# Altium project Mikrofonvorverstärker.PrjPcb
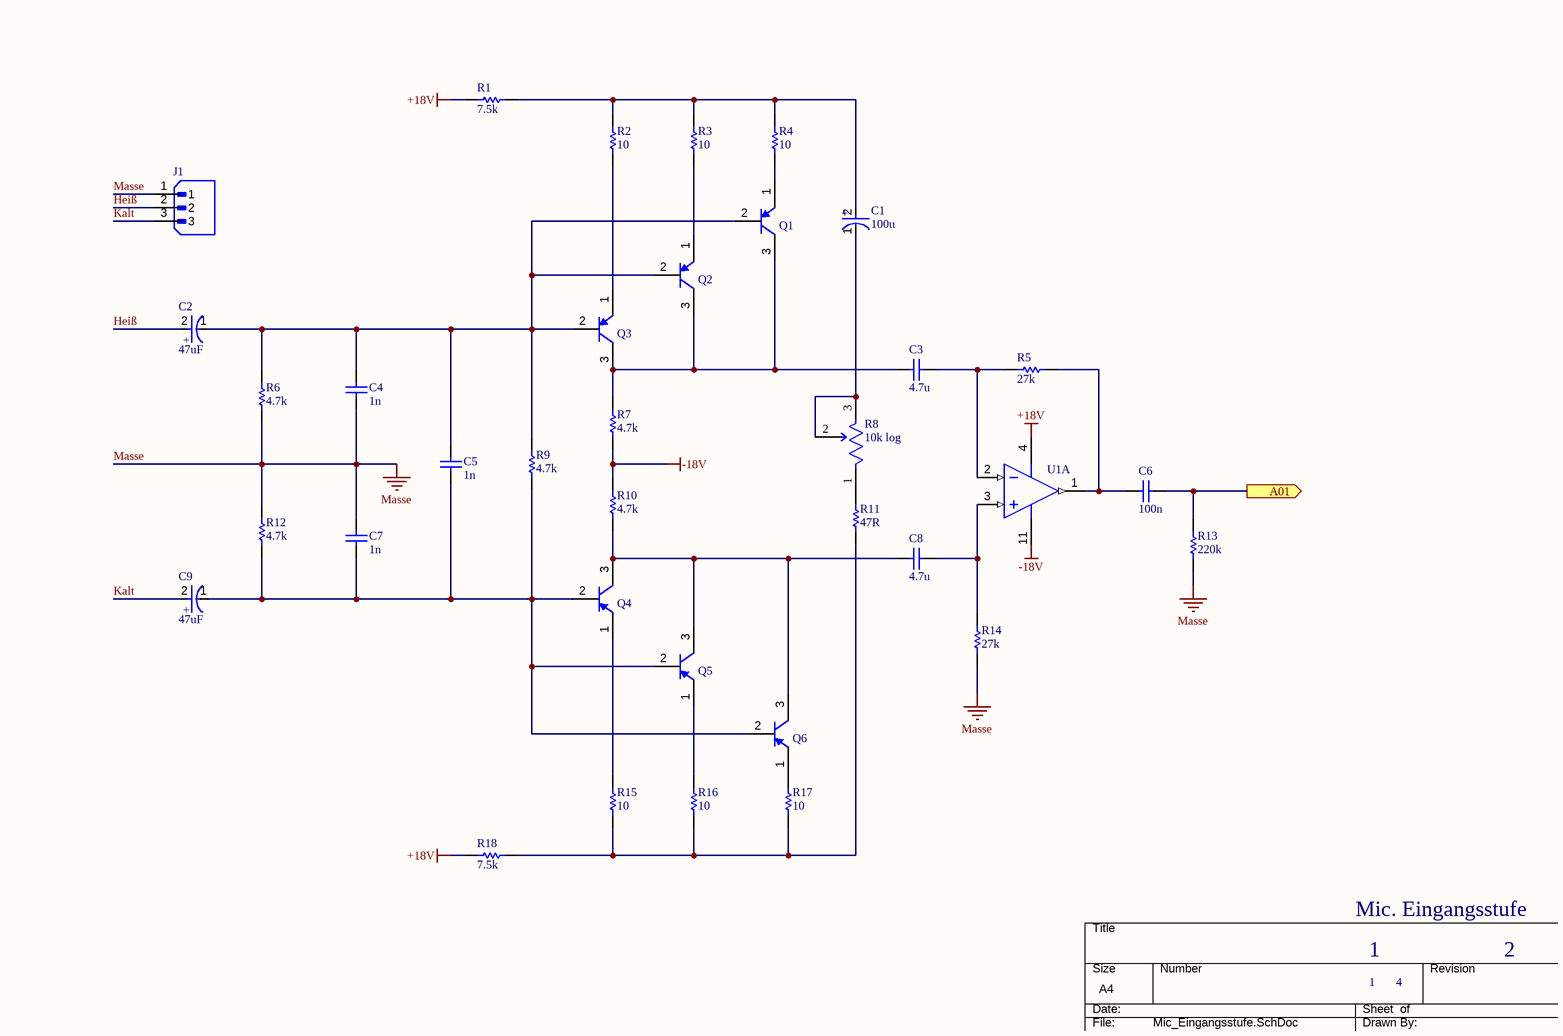
[diagram p0: Mic_Eingangsstufe.SchDoc]
4 sheets, 137 parts. Net scope: flat (ports and power ports of the same name join across sheets).
Board file: Mikrofonvorverstärker.PcbDoc
Sheets:
  Mic_Eingangsstufe.SchDoc
  Linkwitz_Riley.SchDoc
  Parametrischer_EQ.SchDoc
  AUX_Stufe.SchDoc

## Sheet Mic_Eingangsstufe.SchDoc: Mic. Eingangsstufe
size A4; Organization: Altium Limited; Address1: L3, 12a Rodborough Rd; Address2: Frenchs Forest; Address3: NSW; Address4: Australia 2086; DocumentNumber: 1; Revision: 2; SheetNumber: 1; SheetTotal: 4

### Parts
C1  100u  [4141 Kondensator]
C2  47uF  [2626 Kondensator]
C3  4.7u  [0805]
C4  1n  [0805]
C5  1n  [0805]
C6  100n  [0805]
C7  1n  [0805]
C8  4.7u  [0805]
C9  47uF  [2626 Kondensator]
J1  Connector x3  [Connector x3]  (value not drawn)
Q1  PNP  [Buchsenleiste 3 Fach PNP TO92]  (value not drawn)
Q2  PNP  [Buchsenleiste 3 Fach PNP TO92]  (value not drawn)
Q3  PNP  [Buchsenleiste 3 Fach PNP TO92]  (value not drawn)
Q4  PNP  [Buchsenleiste 3 Fach PNP TO92]  (value not drawn)
Q5  PNP  [Buchsenleiste 3 Fach PNP TO92]  (value not drawn)
Q6  PNP  [Buchsenleiste 3 Fach PNP TO92]  (value not drawn)
R1  7.5k  [0805]
R2  10  [0805]
R3  10  [0805]
R4  10  [0805]
R5  27k  [0805]
R6  4.7k  [0805]
R7  4.7k  [0805]
R8  10k log  [Connector x3]
R9  4.7k  [0805]
R10  4.7k  [0805]
R11  47R  [0805]
R12  4.7k  [0805]
R13  220k  [0805]
R14  27k  [0805]
R15  10  [0805]
R16  10  [0805]
R17  10  [0805]
R18  7.5k  [0805]
U1  OPA4134UA  [DIP14 IC Socket]  (value not drawn)  (part A of 4)

### Ports
A01 (out)

### Nets
+18V: R1.1 R18.1 U1.4(V+)
-18V: R7.1 R10.2 U1.11(V-)
Masse: C4.1 C7.2 J1.1 R6.1 R12.2 R13.1 R14.1
Heiß: C2.2(A) J1.2
Kalt: C9.2(A) J1.3
NetC1_1: C1.1(C) R8.2(b) R8.3(c)
NetC1_2: C1.2(A) R1.2 R2.1 R3.1 R4.1
NetC2_1: C2.1(C) C4.2 C5.2 Q1.2(B) Q2.2(B) Q3.2(B) R6.2 R9.2
NetC3_1: C3.1 R5.2 U1.2(IN_A-)
NetC3_2: C3.2 Q1.3(C) Q2.3(C) Q3.3(C) R7.2
NetC5_1: C5.1 C7.1 C9.1(C) Q4.2(B) Q5.2(B) Q6.2(B) R9.1 R12.1
NetC6_1: C6.1 R5.1 U1.1(OUT_A)
NetC6_2: C6.2 R13.2 ; port A01
NetC8_1: C8.1 R14.2 U1.3(IN_A+)
NetC8_2: C8.2 Q4.3(C) Q5.3(C) Q6.3(C) R10.1
NetQ1_1: Q1.1(E) R4.2
NetQ2_1: Q2.1(E) R3.2
NetQ3_1: Q3.1(E) R2.2
NetQ4_1: Q4.1(E) R15.2
NetQ5_1: Q5.1(E) R16.2
NetQ6_1: Q6.1(E) R17.2
NetR8_1: R8.1(a) R11.2
NetR11_1: R11.1 R15.1 R16.1 R17.1 R18.2

### Notes on the sheet
- THIS DOCUMENT AND THE DATA DISCLOSED HEREIN OR
- HEREWITH IS THE PROPERTY OF ALTIUM LIMITED AND MAY
- DWG NO:
- REVISION
- REV:
- DESCRIPTION
- DATE
- APPROVED
- BE FREELY DISTRIBUTED IN WHOLE. NO RIGHTS ARE
- RESERVED OR EXPRESS OR IMPLIED WARANTEE GIVEN.
- ENG:
- APPROVALS
- PROJECT
- DSN:
- CHK:
- REFERENCE DOCUMENTS
- PROJECT REVISION:
- TITLE
- DOCUMENT REVISION:
- DESIGN ITEM:
- BOM:
- FAB DWG:
- PCB DWG:
- ASSY DWG:
- SCALE:
- A3
- SIZE
- CAGE CODE
- FILE NAME
- DWG NO.
- SHEET
- OF
- REV
- (in symbol 2626 Kondensator) +
- (in symbol 4141 Kondensator) +

### Library data of the parts
C1 = 4141 Kondensator: 4141Kondensator; Value: 100u
C2 C9 = 2626 Kondensator: 2626 Kondensator d=6.6mm; Ripple Current: 2.8A; Voltage: 25V; Polarity: Polar; Leakage Current: 235uA; Tolerance: 20%; Dissipation Factor: 12%; ESR (Equivalent Series Resistance): 30mR; Life (Hours): 5000Hour; Diameter: 6.3mm; Package Quantity: 1000; Packaging: Tape and Reel; Height - Seated (Max): 0.236inch; Case/Package: Radial; Termination: SMD/SMT; Series: OS-CON™, SVPF; Number of Pins: 6; Value: 47uF; Min Operating Temperature: -55°C; Mount: Surface Mount; RoHS Compliant: Yes; Voltage Rating (DC): 25V; Length: 5.9mm; REACH SVHC: No SVHC; Voltage Rating: 25V; Ripple Current (AC): 2.8A; Height: 5.9mm; Max Operating Temperature: 105°C
C3-C8 = 0805 Kondensator
  C3 C8: Value: 4.7u
  C4 C5 C7: Value: 1n
  C6: Value: 100n
J1 = Connector x3: Connector Header Through Hole 3 position 0.100 (2.54mm); MF: JST Sales; MP: B3B-XH-A; SnapEDA_Link: https://www.snapeda.com/parts/B3B-XH-A/JST+Sales+America+Inc./view-part/?ref=snap; Package: None; Value: *; Check_prices: https://www.snapeda.com/parts/B3B-XH-A/JST+Sales+America+Inc./view-part/?ref=eda
Q1-Q6 = TO-92 PNP BUchsenleiste: TO-92 PNP Bipolar Transistor; Typ: PNP
R1-R7 R9-R18 = 0805 Widerstand
  R1 R18: Value: 7.5k
  R2-R4 R15-R17: Value: 10
  R5 R14: Value: 27k
  R6 R7 R9 R10 R12: Value: 4.7k
  R11: Value: 47R
  R13: Value: 220k
R8 = Potentiometer Buchsenleiste: Potentiometer; Value: 10k log
U1 = SOIC OPA4134UA: SoundPlus(TM) High Performance Audio Operational Amplifier, 5 to 36 V, -55 to 125 degC, 14-pin SOIC (D14), Green (RoHS & no Sb/Br); Manufacturer: Texas Instruments; Vmax(V): 36; Number of Channels: 4; Iq per channel(Max)(mA): 5; GBW(Typ)(MHz): 8; DatasheetVersion: SBOS058; ComponentLink2URL: http://www.ti.com/general/docs/lit/getliterature.tsp?genericPartNumber=OPA4134&fileType=pdf; ComponentLink1URL: http://www.ti.com/; PackageDescription: 14-Pin Plastic Small Outline, Body 8.65 x 3.9 mm, Pitch 1.27 mm; SubFamily: Audio Operational Amplifier; Vmin(V): 5; ComponentLink2Description: Datasheet; PackageVersion: 4040047-5/M, 06/2011; Code_JEDEC: MS-012; PackageReference: D0014A; ComponentLink1Description: Manufacturer URL; Vn at Flatband(Typ)(nV/rtHz): 8; Eco-Plan: Green (RoHS & no Sb/Br); Mounting Technology: Surface Mount; ComponentLink3URL: http://www.ti.com/lit/ml/mpds177g/mpds177g.pdf; PartNumber: OPA4134UA; ComponentLink3Description: Package Specification

## Sheet Linkwitz_Riley.SchDoc: Linkwitz-Riley / Entstörkondensator
size A4; DocumentNumber: 2; Revision: 2; SheetNumber: 2; SheetTotal: 4
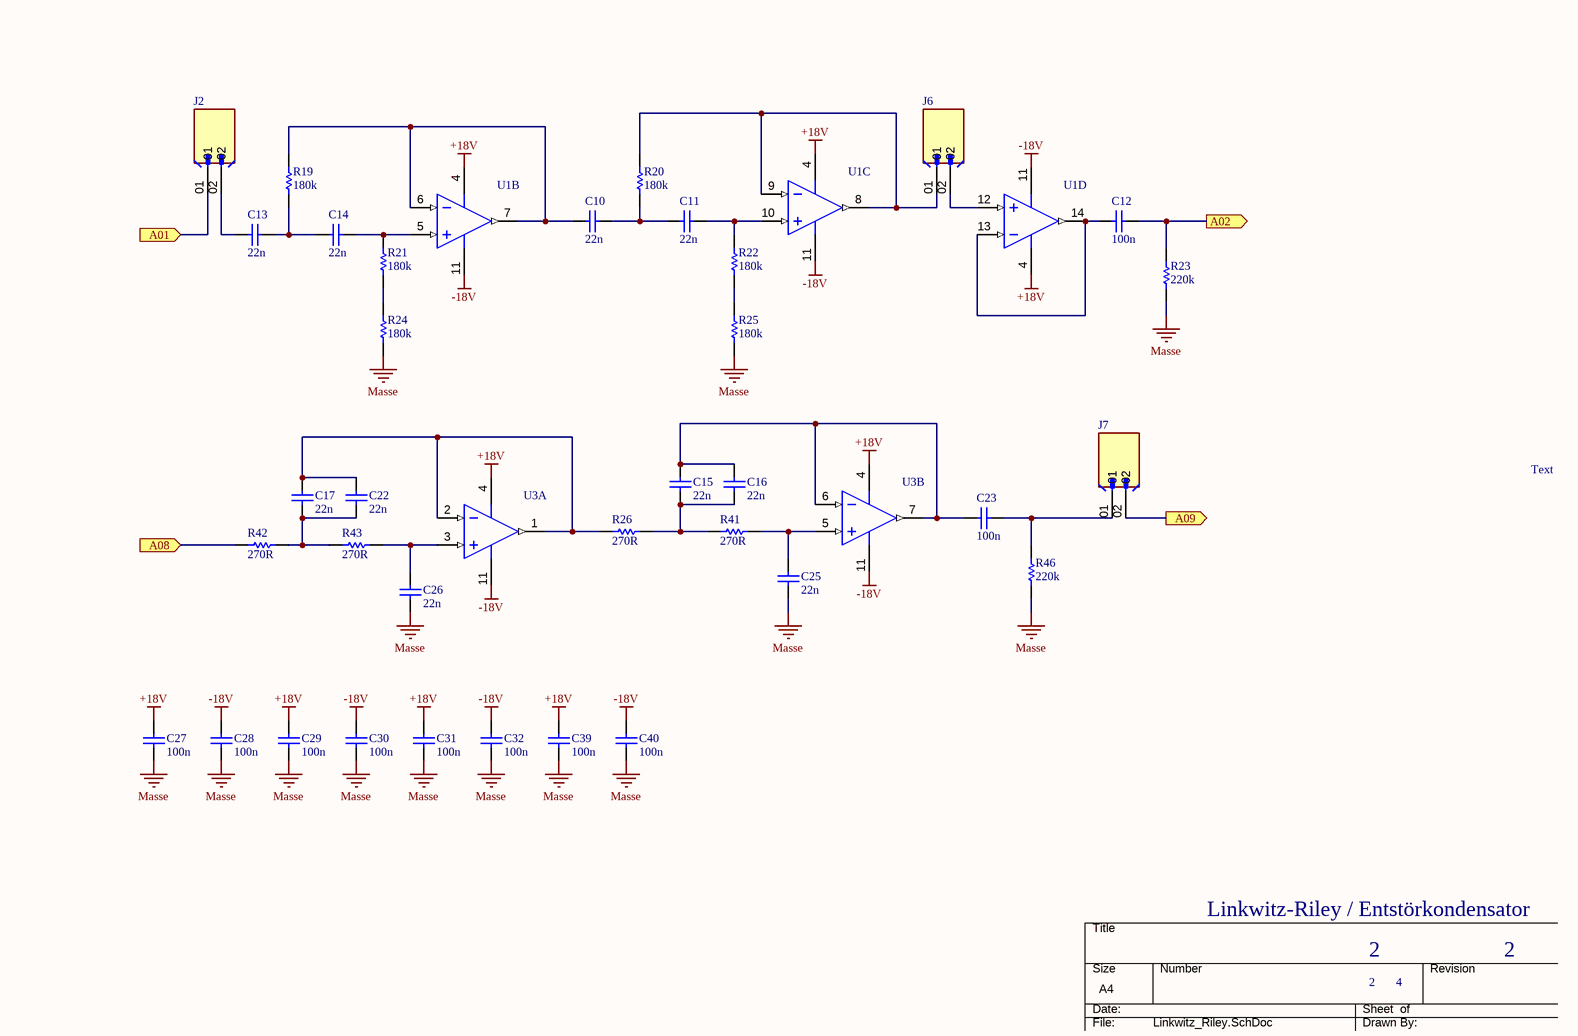
[diagram p1: Linkwitz_Riley.SchDoc]

### Parts
C10  22n  [0805]
C11  22n  [0805]
C12  100n  [0805]
C13  22n  [0805]
C14  22n  [0805]
C15  22n  [0805]
C16  22n  [0805]
C17  22n  [0805]
C22  22n  [0805]
C23  100n  [0805]
C25  22n  [0805]
C26  22n  [0805]
C27  100n  [0805]
C28  100n  [0805]
C29  100n  [0805]
C30  100n  [0805]
C31  100n  [0805]
C32  100n  [0805]
C39  100n  [0805]
C40  100n  [0805]
J2  Connector x2  [Connector x2]  (value not drawn)
J6  Connector x2  [Connector x2]  (value not drawn)
J7  Connector x2  [Connector x2]  (value not drawn)
R19  180k  [0805]
R20  180k  [0805]
R21  180k  [0805]
R22  180k  [0805]
R23  220k  [0805]
R24  180k  [0805]
R25  180k  [0805]
R26  270R  [0805]
R41  270R  [0805]
R42  270R  [0805]
R43  270R  [0805]
R46  220k  [0805]
U1  OPA4134UA  [DIP14 IC Socket]  (value not drawn)  (parts B,C,D of 4)
U3  OPA4134UA  [DIP14 IC Socket]  (value not drawn)  (parts A,B of 4)

### Ports
A01 (in), A02 (out), A08 (in), A09 (out)

### Nets
+18V: C27.2 C29.2 C31.2 C39.2 U1.4(V+) U3.4(V+)
-18V: C28.2 C30.2 C32.2 C40.2 U1.11(V-) U3.11(V-)
Masse: C25.1 C26.1 C27.1 C28.1 C29.1 C30.1 C31.1 C32.1 C39.1 C40.1 R23.1 R24.1 R25.1 R46.1
NetC6_2: J2.01 ; port A01
NetC10_1: C10.1 R19.2 U1.6(IN_B-) U1.7(OUT_B)
NetC10_2: C10.2 C11.1 R20.1
NetC11_2: C11.2 R22.2 U1.10(IN_C+)
NetC12_1: C12.1 U1.13(IN_D-) U1.14(OUT_D)
NetC12_2: C12.2 R23.2 ; port A02
NetC13_1: C13.1 J2.02
NetC13_2: C13.2 C14.1 R19.1
NetC14_2: C14.2 R21.2 U1.5(IN_B+)
NetC15_1: C15.1 C16.1 R26.1 R41.2
NetC15_2: C15.2 C16.2 C23.1 U3.6(IN_B-) U3.7(OUT_B)
NetC17_1: C17.1 C22.1 R42.1 R43.2
NetC17_2: C17.2 C22.2 R26.2 U3.1(OUT_A) U3.2(IN_A-)
NetC23_2: C23.2 J7.01 R46.2
NetC25_2: C25.2 R41.1 U3.5(IN_B+)
NetC26_2: C26.2 R43.1 U3.3(IN_A+)
NetJ5_02: R42.2 ; port A08
NetJ6_01: J6.01 R20.2 U1.8(OUT_C) U1.9(IN_C-)
NetJ6_02: J6.02 U1.12(IN_D+)
NetJ7_02: J7.02 ; port A09
NetR21_1: R21.1 R24.2
NetR22_1: R22.1 R25.2

### Notes on the sheet
- Text
- THIS DOCUMENT AND THE DATA DISCLOSED HEREIN OR
- HEREWITH IS THE PROPERTY OF ALTIUM LIMITED AND MAY
- DWG NO:
- REVISION
- REV:
- DESCRIPTION
- DATE
- APPROVED
- BE FREELY DISTRIBUTED IN WHOLE. NO RIGHTS ARE
- RESERVED OR EXPRESS OR IMPLIED WARANTEE GIVEN.
- ENG:
- APPROVALS
- PROJECT
- DSN:
- CHK:
- REFERENCE DOCUMENTS
- PROJECT REVISION:
- TITLE
- DOCUMENT REVISION:
- DESIGN ITEM:
- BOM:
- FAB DWG:
- PCB DWG:
- ASSY DWG:
- SCALE:
- A3
- SIZE
- CAGE CODE
- FILE NAME
- DWG NO.
- SHEET
- OF
- REV

### Library data of the parts
C10-C17 C22 C23 C25-C32 C39 C40 = 0805 Kondensator
  C10 C11 C13-C17 C22 C25 C26: Value: 22n
  C12 C23 C27-C32 C39 C40: Value: 100n
J2 J6 J7 = Connector x2: Connector Header Through Hole 2 position 0.100 (2.54mm); MF: Wurth Elektronik; MP: 61300211121; SnapEDA_Link: https://www.snapeda.com/parts/61300211121/Wurth+Elektronik/view-part/?ref=snap; Package: None; Value: *; Check_prices: https://www.snapeda.com/parts/61300211121/Wurth+Elektronik/view-part/?ref=eda
R19-R26 R41-R43 R46 = 0805 Widerstand
  R19-R22 R24 R25: Value: 180k
  R23 R46: Value: 220k
  R26 R41-R43: Value: 270R
U1 U3 = SOIC OPA4134UA: as U1 on sheet Mic_Eingangsstufe; DatasheetVersion: SBOS058; ComponentLink2URL: http://www.ti.com/general/docs/lit/getliterature.tsp?genericPartNumber=OPA4134&fileType=pdf; ComponentLink1URL: http://www.ti.com/; PackageDescription: 14-Pin Plastic Small Outline, Body 8.65 x 3.9 mm, Pitch 1.27 mm; SubFamily: Audio Operational Amplifier; Vmin(V): 5; ComponentLink2Description: Datasheet; PackageVersion: 4040047-5/M, 06/2011; Code_JEDEC: MS-012; PackageReference: D0014A; ComponentLink1Description: Manufacturer URL; Vn at Flatband(Typ)(nV/rtHz): 8; Eco-Plan: Green (RoHS & no Sb/Br); Mounting Technology: Surface Mount; ComponentLink3URL: http://www.ti.com/lit/ml/mpds177g/mpds177g.pdf; PartNumber: OPA4134UA; ComponentLink3Description: Package Specification

## Sheet Parametrischer_EQ.SchDoc: Parametrischer EQ / Spannungsregler
size A4 portrait; DocumentNumber: 3; Revision: 2; SheetNumber: 3; SheetTotal: 4
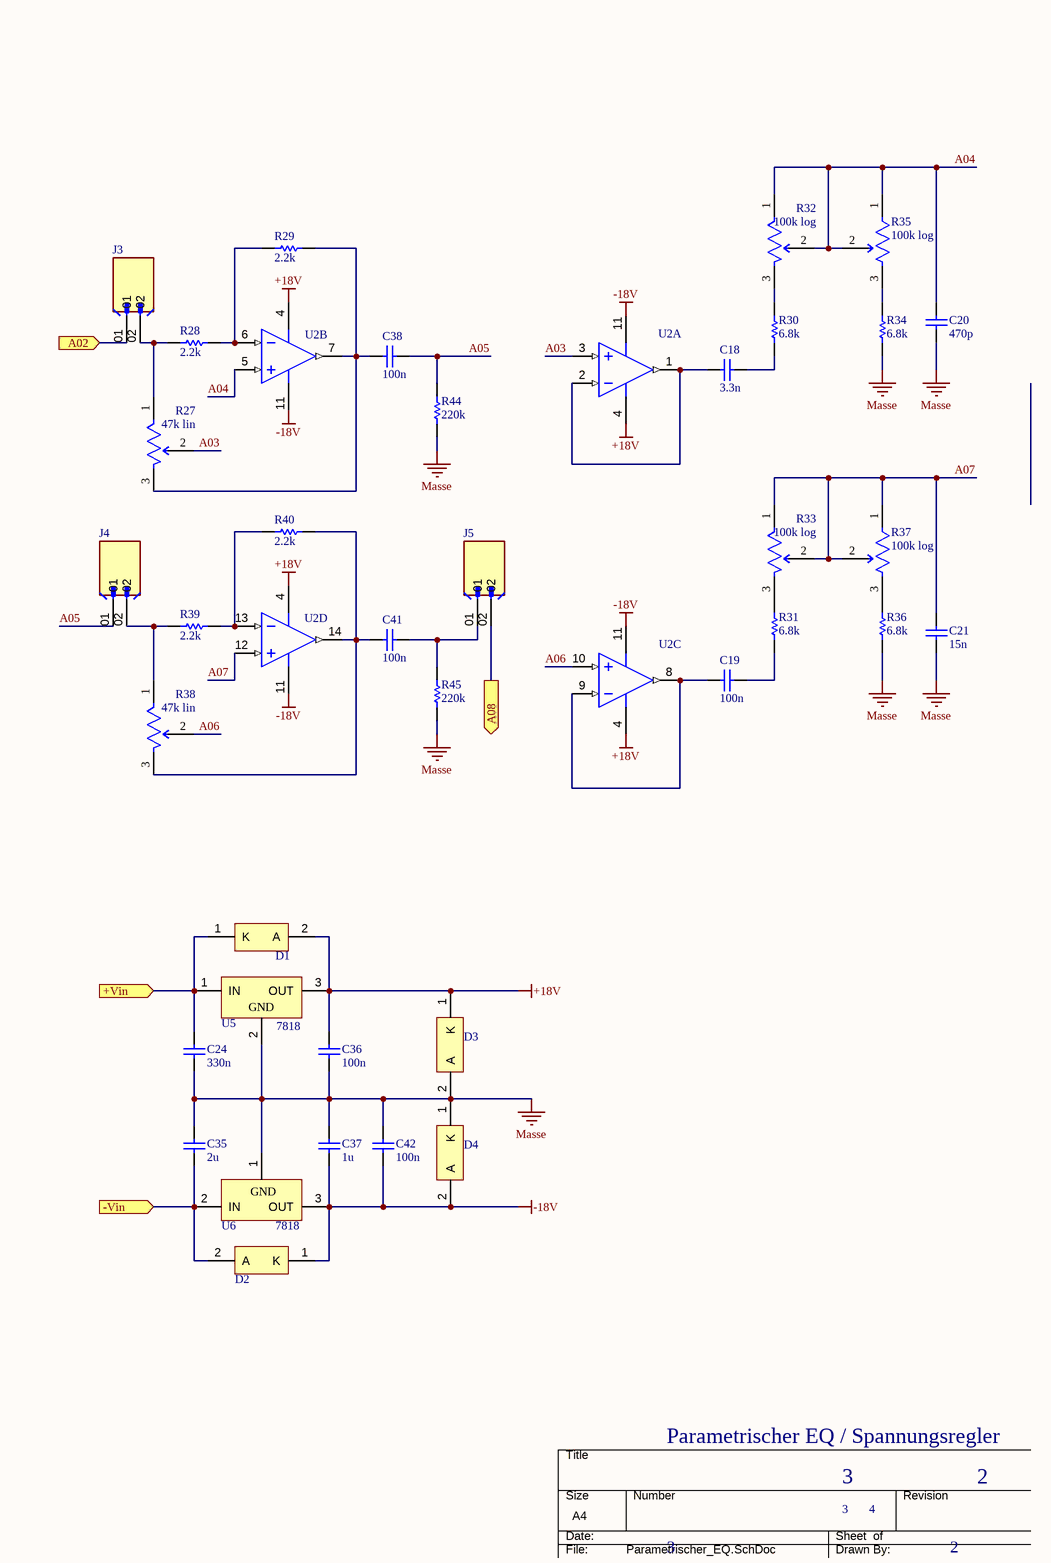
[diagram p2: Parametrischer_EQ.SchDoc]

### Parts
C18  3.3n  [0805]
C19  100n  [0805]
C20  470p  [0805]
C21  15n  [0805]
C24  330n  [0805]
C35  2u  [0805]
C36  100n  [0805]
C37  1u  [0805]
C38  100n  [0805]
C41  100n  [0805]
C42  100n  [0805]
D1  1N4001 Diode  [1N4001 Diode]  (value not drawn)
D2  1N4001 Diode  [1N4001 Diode]  (value not drawn)
D3  1N4001 Diode  [1N4001 Diode]  (value not drawn)
D4  1N4001 Diode  [1N4001 Diode]  (value not drawn)
J3  Connector x2  [Connector x2]  (value not drawn)
J4  Connector x2  [Connector x2]  (value not drawn)
J5  Connector x2  [Connector x2]  (value not drawn)
R27  47k lin  [Connector x3]
R28  2.2k  [0805]
R29  2.2k  [0805]
R30  6.8k  [0805]
R31  6.8k  [0805]
R32  100k log  [Connector x3]
R33  100k log  [Connector x3]
R34  6.8k  [0805]
R35  100k log  [Connector x3]
R36  6.8k  [0805]
R37  100k log  [Connector x3]
R38  47k lin  [Connector x3]
R39  2.2k  [0805]
R40  2.2k  [0805]
R44  220k  [0805]
R45  220k  [0805]
U2  OPA4134UA  [DIP14 IC Socket]  (value not drawn)  (parts A,B,C,D of 4)
U5  7818  [TO220 Spannungsregler 78xx]
U6  7818  [TO220 Spannungsregler 79xx]

### Ports
+Vin (in), -Vin (in), A02 (in), A08 (out)

### Nets
+18V: C36.2 D1.2(A) D3.1(K) U2.4(V+) U5.3(OUT)
-18V: C37.2 C42.1 D2.1(K) D4.2(A) U2.11(V-) U6.3(OUT)
Masse: C20.1 C21.2 C24.1 C35.1 C36.1 C37.1 C42.2 D3.2(A) D4.1(K) R34.1 R36.2 R44.1 R45.1 U5.2(GND) U6.1(GND)
+Vin: C24.2 D1.1(K) U5.1(IN) ; port +Vin
-Vin: C35.2 D2.2(A) U6.2(IN) ; port -Vin
A03: R27.2(b) U2.3(IN_A+)
A04: C20.2 R32.1(a) R32.2(b) R35.1(a) R35.2(b) U2.5(IN_B+)
A05: C38.2 J4.01 R44.2
A06: R38.2(b) U2.10(IN_C+)
A07: C21.1 R33.1(a) R33.2(b) R37.1(a) R37.2(b) U2.12(IN_D+)
NetC12_2: J3.01 ; port A02
NetC18_1: C18.1 U2.1(OUT_A) U2.2(IN_A-)
NetC18_2: C18.2 R30.1
NetC19_1: C19.1 R31.2
NetC19_2: C19.2 U2.8(OUT_C) U2.9(IN_C-)
NetC38_1: C38.1 R27.3(c) R29.2 U2.7(OUT_B)
NetC41_1: C41.1 R38.3(c) R40.2 U2.14(OUT_D)
NetC41_2: C41.2 J5.01 R45.2
NetJ3_02: J3.02 R27.1(a) R28.1
NetJ4_02: J4.02 R38.1(a) R39.1
NetJ5_02: J5.02 ; port A08
NetR28_2: R28.2 R29.1 U2.6(IN_B-)
NetR30_2: R30.2 R32.3(c)
NetR31_1: R31.1 R33.3(c)
NetR34_2: R34.2 R35.3(c)
NetR36_1: R36.1 R37.3(c)
NetR39_2: R39.2 R40.1 U2.13(IN_D-)

### Notes on the sheet
- THIS DOCUMENT AND THE DATA DISCLOSED HEREIN OR
- HEREWITH IS THE PROPERTY OF ALTIUM LIMITED AND MAY
- DWG NO:
- REVISION
- REV:
- DESCRIPTION
- DATE
- APPROVED
- BE FREELY DISTRIBUTED IN WHOLE. NO RIGHTS ARE
- RESERVED OR EXPRESS OR IMPLIED WARANTEE GIVEN.
- ENG:
- APPROVALS
- PROJECT
- DSN:
- CHK:
- REFERENCE DOCUMENTS
- PROJECT REVISION:
- TITLE
- DOCUMENT REVISION:
- DESIGN ITEM:
- BOM:
- FAB DWG:
- PCB DWG:
- ASSY DWG:
- SCALE:
- A3
- SIZE
- CAGE CODE
- FILE NAME
- DWG NO.
- SHEET
- OF
- REV

### Library data of the parts
C18-C21 C24 C35-C38 C41 C42 = 0805 Kondensator
  C18: Value: 3.3n
  C19 C36 C38 C41 C42: Value: 100n
  C20: Value: 470p
  C21: Value: 15n
  C24: Value: 330n
  C35: Value: 2u
  C37: Value: 1u
D1-D4 = 1N4001 Diode: Standard Recovery Rectifier, 2-Pin Axial_Lead, Pb-Free, Bulk Bag; Manufacturer: On Semiconductor; VRRM Max (V): 50; IFSM Max (A): 30; IO(rec) Max (A): 1; ComponentLink3URL: http://www.onsemi.cn/pub_link/Collateral/59-10.PDF; ComponentLink3Description: Package Specification; PartNumber: 1N4001; PackageVersion: Rev. U, 02/2005; Packing: Bulk Bag; ComponentLink2Description: Datasheet; RoHS: TRUE; DatasheetVersion: Rev. 13; PackageReference: AXIAL_LEAD-2-59-10; ComponentLink1URL: http://www.onsemi.com/; Mounting Technology: Through Hole; PackageDescription: 2-Pin, Axial Lead, Diameter 2.35 mm; ComponentLink2URL: http://www.onsemi.com/pub_link/Collateral/1N4001-D.PDF; Type: Standard Recovery; ComponentLink1Description: Manufacturer URL
J3-J5 = Connector x2: as J2 on sheet Linkwitz_Riley; SnapEDA_Link: https://www.snapeda.com/parts/61300211121/Wurth+Elektronik/view-part/?ref=snap; Package: None; Value: *; Check_prices: https://www.snapeda.com/parts/61300211121/Wurth+Elektronik/view-part/?ref=eda
R27 R32 R33 R35 R37 R38 = Potentiometer Buchsenleiste: Potentiometer
  R27 R38: Value: 47k lin
  R32 R33 R35 R37: Value: 100k log
R28-R31 R34 R36 R39 R40 R44 R45 = 0805 Widerstand
  R28 R29 R39 R40: Value: 2.2k
  R30 R31 R34 R36: Value: 6.8k
  R44 R45: Value: 220k
U2 = SOIC OPA4134UA: as U1 on sheet Mic_Eingangsstufe; DatasheetVersion: SBOS058; ComponentLink2URL: http://www.ti.com/general/docs/lit/getliterature.tsp?genericPartNumber=OPA4134&fileType=pdf; ComponentLink1URL: http://www.ti.com/; PackageDescription: 14-Pin Plastic Small Outline, Body 8.65 x 3.9 mm, Pitch 1.27 mm; SubFamily: Audio Operational Amplifier; Vmin(V): 5; ComponentLink2Description: Datasheet; PackageVersion: 4040047-5/M, 06/2011; Code_JEDEC: MS-012; PackageReference: D0014A; ComponentLink1Description: Manufacturer URL; Vn at Flatband(Typ)(nV/rtHz): 8; Eco-Plan: Green (RoHS & no Sb/Br); Mounting Technology: Surface Mount; ComponentLink3URL: http://www.ti.com/lit/ml/mpds177g/mpds177g.pdf; PartNumber: OPA4134UA; ComponentLink3Description: Package Specification
U5 = TO 220 Spannungsregler 78xx: Voltage Regulator, 3-Pin TO-220; Typ: 7818
U6 = TO 220 Spannungsregler 79xx: Voltage Regulator, 3-Pin TO-220; Typ: 7818

## Sheet AUX_Stufe.SchDoc: Ausgangsstufe
size A4 portrait; DocumentNumber: 4; Revision: 2; SheetNumber: 4; SheetTotal: 4
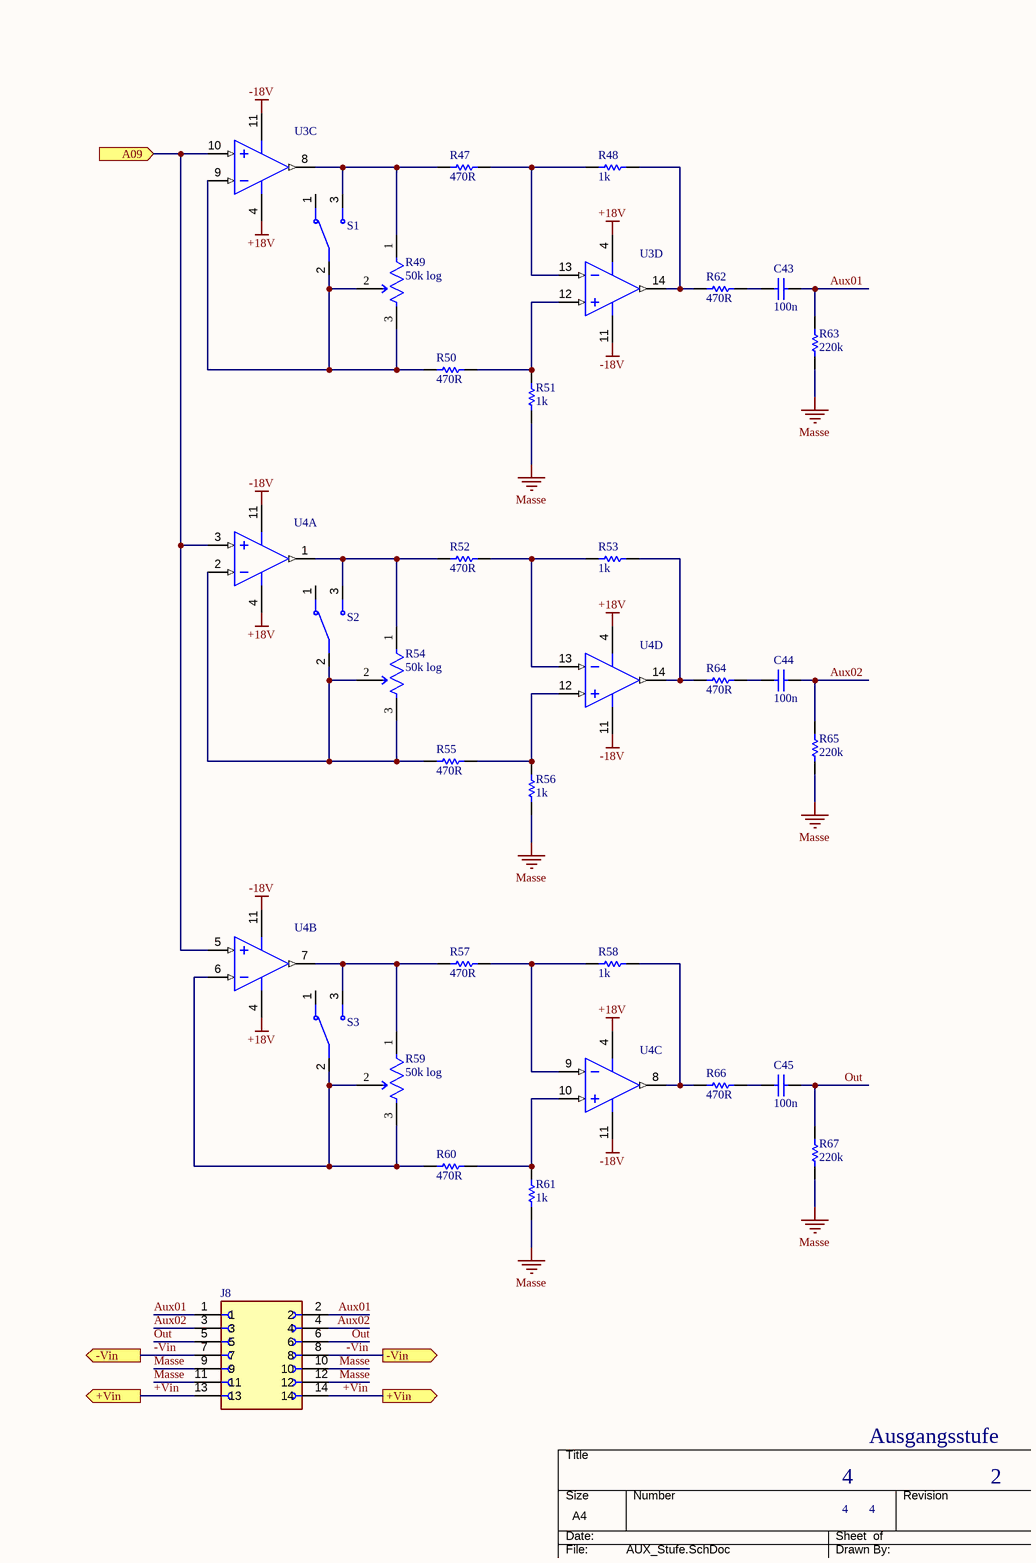
[diagram p3: AUX_Stufe.SchDoc]

### Parts
C43  100n  [0805]
C44  100n  [0805]
C45  100n  [0805]
J8  Connector x14  [Connector x14]  (value not drawn)
R47  470R  [0805]
R48  1k  [0805]
R49  50k log  [Connector x3]
R50  470R  [0805]
R51  1k  [0805]
R52  470R  [0805]
R53  1k  [0805]
R54  50k log  [Connector x3]
R55  470R  [0805]
R56  1k  [0805]
R57  470R  [0805]
R58  1k  [0805]
R59  50k log  [Connector x3]
R60  470R  [0805]
R61  1k  [0805]
R62  470R  [0805]
R63  220k  [0805]
R64  470R  [0805]
R65  220k  [0805]
R66  470R  [0805]
R67  220k  [0805]
S1  Schalter Buchsenleiste  [Connector x3]  (value not drawn)
S2  Schalter Buchsenleiste  [Connector x3]  (value not drawn)
S3  Schalter Buchsenleiste  [Connector x3]  (value not drawn)
U3  OPA4134UA  [DIP14 IC Socket]  (value not drawn)  (parts C,D of 4)
U4  OPA4134UA  [DIP14 IC Socket]  (value not drawn)  (parts A,B,C,D of 4)

### Ports
+Vin (out), -Vin (out), A09 (in)

### Nets
+18V: U3.4(V+) U4.4(V+)
-18V: U3.11(V-) U4.11(V-)
Masse: J8.9 J8.10 J8.11 J8.12 R51.1 R56.1 R61.1 R63.1 R65.1 R67.1
+Vin: J8.13 J8.14 ; port +Vin
-Vin: J8.7 J8.8 ; port -Vin
Aux01: C43.2 J8.1 J8.2 R63.2
Aux02: C44.2 J8.3 J8.4 R65.2
Out: C45.2 J8.5 J8.6 R67.2
NetC43_1: C43.1 R62.2
NetC44_1: C44.1 R64.2
NetC45_1: C45.1 R66.2
NetJ7_02: U3.10(IN_C+) U4.3(IN_A+) U4.5(IN_B+) ; port A09
NetR47_1: R47.1 R49.1(a) S1.3 U3.8(OUT_C)
NetR47_2: R47.2 R48.1 U3.13(IN_D-)
NetR48_2: R48.2 R62.1 U3.14(OUT_D)
NetR49_2: R49.2(b) R49.3(c) R50.1 S1.2 U3.9(IN_C-)
NetR50_2: R50.2 R51.2 U3.12(IN_D+)
NetR52_1: R52.1 R54.1(a) S2.3 U4.1(OUT_A)
NetR52_2: R52.2 R53.1 U4.13(IN_D-)
NetR53_2: R53.2 R64.1 U4.14(OUT_D)
NetR54_2: R54.2(b) R54.3(c) R55.1 S2.2 U4.2(IN_A-)
NetR55_2: R55.2 R56.2 U4.12(IN_D+)
NetR57_1: R57.1 R59.1(a) S3.3 U4.7(OUT_B)
NetR57_2: R57.2 R58.1 U4.9(IN_C-)
NetR58_2: R58.2 R66.1 U4.8(OUT_C)
NetR59_2: R59.2(b) R59.3(c) R60.1 S3.2 U4.6(IN_B-)
NetR60_2: R60.2 R61.2 U4.10(IN_C+)

Not connected (* = marked no-connect by the designer): S1 1; S2 1; S3 1

### Notes on the sheet
- THIS DOCUMENT AND THE DATA DISCLOSED HEREIN OR
- HEREWITH IS THE PROPERTY OF ALTIUM LIMITED AND MAY
- DWG NO:
- REVISION
- REV:
- DESCRIPTION
- DATE
- APPROVED
- BE FREELY DISTRIBUTED IN WHOLE. NO RIGHTS ARE
- RESERVED OR EXPRESS OR IMPLIED WARANTEE GIVEN.
- ENG:
- APPROVALS
- PROJECT
- DSN:
- CHK:
- REFERENCE DOCUMENTS
- PROJECT REVISION:
- TITLE
- DOCUMENT REVISION:
- DESIGN ITEM:
- BOM:
- FAB DWG:
- PCB DWG:
- ASSY DWG:
- SCALE:
- A3
- SIZE
- CAGE CODE
- FILE NAME
- DWG NO.
- SHEET
- OF
- REV

### Library data of the parts
C43-C45 = 0805 Kondensator: Value: 100n
J8 = Connector x14: 14 Position Header Connector Through Hole; MF: Sullins Connector; MP: SFH11-PBPC-D07-ST-BK; Value: *; Check_prices: https://www.snapeda.com/parts/SFH11-PBPC-D07-ST-BK/Sullins%20Connector%20Solutions/view-part/851415/?ref=eda; Availability: Warning; Package: None; SnapEDA_Link: https://www.snapeda.com/parts/SFH11-PBPC-D07-ST-BK/Sullins%20Connector%20Solutions/view-part/851415/?ref=snap; Purchase-URL: https://pricing.snapeda.com/search/part/SFH11-PBPC-D07-ST-BK/?ref=eda; Price: None
R47 R48 R50-R53 R55-R58 R60-R67 = 0805 Widerstand
  R47 R50 R52 R55 R57 R60 R62 R64 R66: Value: 470R
  R48 R51 R53 R56 R58 R61: Value: 1k
  R63 R65 R67: Value: 220k
R49 R54 R59 = Potentiometer Buchsenleiste: Potentiometer; Value: 50k log
S1-S3 = Schalter Buchsenleiste: Toggle Switch SPDT Through Hole; MP: 100SP1T1B4M2QE; Package: None; Price: None; Value: *; Availability: Unavailable
U3 U4 = SOIC OPA4134UA: as U1 on sheet Mic_Eingangsstufe; DatasheetVersion: SBOS058; ComponentLink2URL: http://www.ti.com/general/docs/lit/getliterature.tsp?genericPartNumber=OPA4134&fileType=pdf; ComponentLink1URL: http://www.ti.com/; PackageDescription: 14-Pin Plastic Small Outline, Body 8.65 x 3.9 mm, Pitch 1.27 mm; SubFamily: Audio Operational Amplifier; Vmin(V): 5; ComponentLink2Description: Datasheet; PackageVersion: 4040047-5/M, 06/2011; Code_JEDEC: MS-012; PackageReference: D0014A; ComponentLink1Description: Manufacturer URL; Vn at Flatband(Typ)(nV/rtHz): 8; Eco-Plan: Green (RoHS & no Sb/Br); Mounting Technology: Surface Mount; ComponentLink3URL: http://www.ti.com/lit/ml/mpds177g/mpds177g.pdf; PartNumber: OPA4134UA; ComponentLink3Description: Package Specification

## Nets that join several sheets
+18V: Mic_Eingangsstufe (R1.1 R18.1 U1.4), Linkwitz_Riley (6 pins), Parametrischer_EQ (5 pins), AUX_Stufe (U3.4 U4.4)
-18V: Mic_Eingangsstufe (R7.1 R10.2 U1.11), Linkwitz_Riley (6 pins), Parametrischer_EQ (6 pins), AUX_Stufe (U3.11 U4.11)
Masse: Mic_Eingangsstufe (7 pins), Linkwitz_Riley (14 pins), Parametrischer_EQ (15 pins), AUX_Stufe (10 pins)
+Vin: Parametrischer_EQ (C24.2 D1.1 U5.1), AUX_Stufe (J8.13 J8.14)
-Vin: Parametrischer_EQ (C35.2 D2.2 U6.2), AUX_Stufe (J8.7 J8.8)
NetC6_2: Mic_Eingangsstufe (C6.2 R13.2), Linkwitz_Riley (J2.01)
NetC12_2: Linkwitz_Riley (C12.2 R23.2), Parametrischer_EQ (J3.01)
NetJ5_02: Linkwitz_Riley (R42.2), Parametrischer_EQ (J5.02)
NetJ7_02: Linkwitz_Riley (J7.02), AUX_Stufe (U3.10 U4.3 U4.5)